# Altium schematic sheet FMCPower.SchDoc
size Letter; PageSetup: Record=PageOptions|CenterHorizontal=True|CenterVertical=True|PrintScale=1.00|XCorrection=1.00|YCorrection=1.00|PrintKind=0|BorderSize=5000000|LeftOffset=0|BottomOffset=0|Orientation=2|PaperLength=1000|PaperWidth=1000|Scale=100|PaperSource=7|PrintQuality=-4|MediaType=1|DitherType=10|PaperKind=Letter|PrintScaleMode=1; Author: Adam Gilbert; CompanyName: McGill University; DrawnBy: Adam Gilbert; Organization: Altium Limited; Address1: McGill Cosmology; Address2: 3600 University Street; Address3: Montreal, Quebec; Address4: Canada; DocumentNumber: 2; Revision: Rev2; SheetNumber: 2; SheetTotal: 16; ProjectTitle: DfMux FMC Mezz; ModelNumber: MGMEZZ04; ProjectName: DfMux FMC Mezz
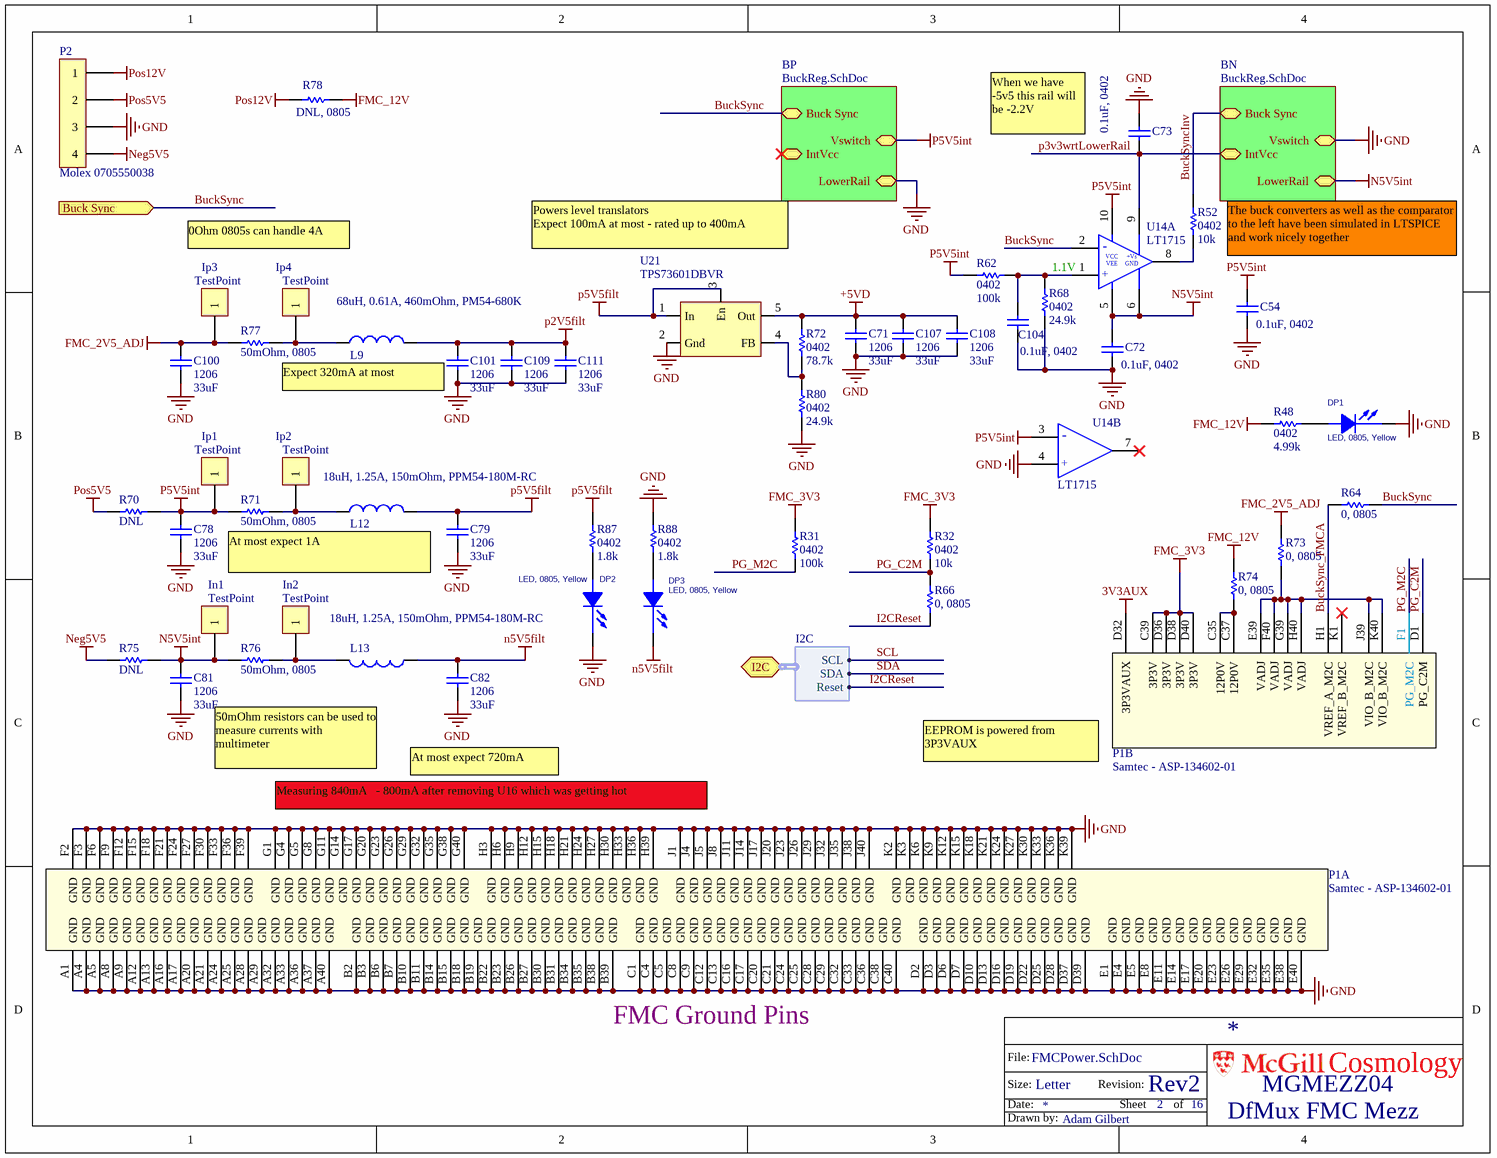
[diagram p0: FMCPower.SchDoc]

## Parts
C54  0.1uF, 0402  [0402]
C71  Footprint: 1206  [CC3225-1210]  (hidden comment: 33uF)
C72  0.1uF, 0402  [0402]
C73  0.1uF, 0402  [0402]
C78  Footprint: 1206  [CC3225-1210]  (hidden comment: 33uF)
C79  Footprint: 1206  [CC3225-1210]  (hidden comment: 33uF)
C81  Footprint: 1206  [CC3225-1210]  (hidden comment: 33uF)
C82  Footprint: 1206  [CC3225-1210]  (hidden comment: 33uF)
C100  Footprint: 1206  [CC3225-1210]  (hidden comment: 33uF)
C101  Footprint: 1206  [CC3225-1210]  (hidden comment: 33uF)
C104  0.1uF, 0402  [0402]
C107  Footprint: 1206  [CC3225-1210]  (hidden comment: 33uF)
C108  Footprint: 1206  [CC3225-1210]  (hidden comment: 33uF)
C109  Footprint: 1206  [CC3225-1210]  (hidden comment: 33uF)
C111  Footprint: 1206  [CC3225-1210]  (hidden comment: 33uF)
DP1  LED, 0805, Yellow  [0805L]
DP2  LED, 0805, Yellow  [0805L]
DP3  LED, 0805, Yellow  [0805L]
In1  TestPoint  [TP-3520-SK]  (no BOM)
In2  TestPoint  [TP-3520-SK]  (no BOM)
Ip1  TestPoint  [TP-3520-SK]  (no BOM)
Ip2  TestPoint  [TP-3520-SK]  (no BOM)
Ip3  TestPoint  [TP-3520-SK]  (no BOM)
Ip4  TestPoint  [TP-3520-SK]  (no BOM)
L9  Part Constraints: 68uH, 0.61A, 460mOhm, PM54-680K  [CHOKEPM54]  (hidden comment: 68uH)
L12  Part Constraints: 18uH, 1.25A, 150mOhm, PPM54-180M-RC  [CHOKEPM54]  (hidden comment: 18uH)
L13  Part Constraints: 18uH, 1.25A, 150mOhm, PPM54-180M-RC  [CHOKEPM54]  (hidden comment: 18uH)
P1  Samtec - ASP-134602-01  [BTB-SM1-27-2V400M]  (parts A,B of 14)
P2  Molex 0705550038  [Molex0705550038]
R31  100k  [0402]
R32  10k  [0402]
R48  4.99k  [0402]
R52  10k  [0402]
R62  100k  [0402]
R64  0, 0805  [0805]
R66  0, 0805  [0805]
R68  24.9k  [0402]
R70  DNL  [0805]
R71  50mOhm, 0805  [0805]
R72  78.7k  [0402]
R73  0, 0805  [0805]
R74  0, 0805  [0805]
R75  DNL  [0805]
R76  50mOhm, 0805  [0805]
R77  50mOhm, 0805  [0805]
R78  DNL, 0805  [0805]
R80  24.9k  [0402]
R87  1.8k  [0402]
R88  1.8k  [0402]
U14  LT1715  [TSSOP50P490X110-10N]  (parts A,B of 2)
U21  TPS73601DBVR  [SOT23-5]

## Sub-sheets
BN = BuckReg.SchDoc: Buck Sync, LowerRail, Vswitch, IntVcc
BP = BuckReg.SchDoc: Buck Sync, LowerRail, Vswitch, IntVcc

## Ports
Buck Sync (in), I2C (harness I2C)

## Harnesses
I2C: SCL, SDA, Reset

## Nets
3V3AUX: P1.D32(3P3VAUX)
+5VD: C71.1 C107.1 C108.1 R72.2 U21.5(Out)
FMC_2V5_ADJ: C100.1 Ip3.1 R73.2 R77.1
FMC_3V3: P1.C39(3P3V) P1.D36(3P3V) P1.D38(3P3V) P1.D40(3P3V) R31.1 R32.1
FMC_12V: R48.1 R74.2 R78.2
GND: C54.1 C71.2 C72.1 C73.2 C78.2 C79.2 C81.2 C82.2 C100.2 C101.2 C104.1 C107.2 C108.2 C109.2 C111.2 DP1.2(CATHODE) DP2.2(CATHODE) P1.A1(GND) P1.A4(GND) P1.A5(GND) P1.A8(GND) P1.A9(GND) P1.A12(GND) P1.A13(GND) P1.A16(GND) P1.A17(GND) P1.A20(GND) P1.A21(GND) P1.A24(GND) P1.A25(GND) P1.A28(GND) P1.A29(GND) P1.A32(GND) P1.A33(GND) P1.A36(GND) P1.A37(GND) P1.A40(GND) P1.B2(GND) P1.B3(GND) P1.B6(GND) P1.B7(GND) P1.B10(GND) P1.B11(GND) P1.B14(GND) P1.B15(GND) P1.B18(GND) P1.B19(GND) P1.B22(GND) P1.B23(GND) P1.B26(GND) P1.B27(GND) P1.B30(GND) P1.B31(GND) P1.B34(GND) P1.B35(GND) P1.B38(GND) P1.B39(GND) P1.C1(GND) P1.C4(GND) P1.C5(GND) P1.C8(GND) P1.C9(GND) P1.C12(GND) P1.C13(GND) P1.C16(GND) P1.C17(GND) P1.C20(GND) P1.C21(GND) P1.C24(GND) P1.C25(GND) P1.C28(GND) P1.C29(GND) P1.C32(GND) P1.C33(GND) P1.C36(GND) P1.C38(GND) P1.C40(GND) P1.D2(GND) P1.D3(GND) P1.D6(GND) P1.D7(GND) P1.D10(GND) P1.D13(GND) P1.D16(GND) P1.D19(GND) P1.D22(GND) P1.D25(GND) P1.D28(GND) P1.D37(GND) P1.D39(GND) P1.E1(GND) P1.E4(GND) P1.E5(GND) P1.E8(GND) P1.E11(GND) P1.E14(GND) P1.E17(GND) P1.E20(GND) P1.E23(GND) P1.E26(GND) P1.E29(GND) P1.E32(GND) P1.E35(GND) P1.E38(GND) P1.E40(GND) P1.F2(GND) P1.F3(GND) P1.F6(GND) P1.F9(GND) P1.F12(GND) P1.F15(GND) P1.F18(GND) P1.F21(GND) P1.F24(GND) P1.F27(GND) P1.F30(GND) P1.F33(GND) P1.F36(GND) P1.F39(GND) P1.G1(GND) P1.G4(GND) P1.G5(GND) P1.G8(GND) P1.G11(GND) P1.G14(GND) P1.G17(GND) P1.G20(GND) P1.G23(GND) P1.G26(GND) P1.G29(GND) P1.G32(GND) P1.G35(GND) P1.G38(GND) P1.G40(GND) P1.H3(GND) P1.H6(GND) P1.H9(GND) P1.H12(GND) P1.H15(GND) P1.H18(GND) P1.H21(GND) P1.H24(GND) P1.H27(GND) P1.H30(GND) P1.H33(GND) P1.H36(GND) P1.H39(GND) P1.J1(GND) P1.J4(GND) P1.J5(GND) P1.J8(GND) P1.J11(GND) P1.J14(GND) P1.J17(GND) P1.J20(GND) P1.J23(GND) P1.J26(GND) P1.J29(GND) P1.J32(GND) P1.J35(GND) P1.J38(GND) P1.J40(GND) P1.K2(GND) P1.K3(GND) P1.K6(GND) P1.K9(GND) P1.K12(GND) P1.K15(GND) P1.K18(GND) P1.K21(GND) P1.K24(GND) P1.K27(GND) P1.K30(GND) P1.K33(GND) P1.K36(GND) P1.K39(GND) P2.3 R68.2 R80.1 R88.1 U14.4(+) U21.2(Gnd) ; sheet BP/LowerRail, sheet BN/Vswitch
n5V5filt: C82.1 DP3.2(CATHODE) L13.1
N5V5int: C72.2 C81.1 In1.1 R75.1 R76.1 U14.5(Vee) U14.6(Gnd) ; sheet BN/LowerRail
Neg5V5: P2.4 R75.2
p2V5filt: C101.1 C109.1 C111.1 L9.2
p5V5filt: C79.1 L12.2 R87.1 U21.1(In) U21.3(En)
P5V5int: C54.2 C78.1 Ip1.1 R62.1 R70.1 R71.1 U14.3(-) U14.10(Vcc) ; sheet BP/Vswitch
Pos5V5: P2.2 R70.2
Pos12V: P2.1 R78.1
BuckSync: R64.1 U14.2(-) ; port Buck Sync, sheet BP/Buck Sync
BuckSync_FMCA: P1.H1(VREF_A_M2C) R64.2
BuckSyncInv: R52.1 ; sheet BN/Buck Sync
I2CReset: R66.2 ; port I2C.Reset
p3v3wrtLowerRail: C73.1 U14.9(Vs) ; sheet BN/IntVcc
PG_C2M: P1.D1(PG_C2M) R32.2 R66.1
PG_M2C: P1.F1(PG_M2C) R31.2
SCL: port I2C.SCL
SDA: port I2C.SDA
NetC104_2: C104.2 R62.2 R68.1 U14.1(+)
NetDP1_1: DP1.1(ANODE) R48.2
NetDP2_1: DP2.1(ANODE) R87.2
NetDP3_1: DP3.1(ANODE) R88.2
NetIn2_1: In2.1 L13.2 R76.2
NetIp2_1: Ip2.1 L12.1 R71.2
NetIp4_1: Ip4.1 L9.1 R77.2
NetP1_C35: P1.C35(12P0V) P1.C37(12P0V) R74.1
NetP1_E39: P1.E39(VADJ) P1.F40(VADJ) P1.G39(VADJ) P1.H40(VADJ) P1.J39(VIO_B_M2C) P1.K40(VIO_B_M2C) R73.1
NetR52_2: R52.2 U14.8(Out)
NetR72_1: R72.1 R80.2 U21.4(FB)

Not connected (* = marked no-connect by the designer): P1 K1(VREF_B_M2C)*; U14 7(Out)*

## Notes on the sheet
- When we have -5v5 this rail will be -2.2V
- 0Ohm 0805s can handle 4A
- Powers level translators
  Expect 100mA at most - rated up to 400mA
- 1.1V
- The buck converters as well as the comparator to the left have been simulated in LTSPICE and work nicely together
- Expect 320mA at most
- At most expect 1A
- 50mOhm resistors can be used to measure currents with multimeter
- At most expect 720mA
- EEPROM is powered from 3P3VAUX
- Measuring 840mA   - 800mA after removing U16 which was getting hot
- (near P1) FMC Ground Pins
- File:
- Size:
- Date:
- Letter
- Revision:
- Sheet
- of
- Cosmology
- Drawn by:
- (in symbol LT1715, part A) VCC; +Vs; VEE; GND

## Library data of the parts
C54 C72 C73 C104 = CAP 0603: Capacitor, Ceramic, 0402; Part Constraints: 10% 10V X5R 0402; Manufacturer: TDK Corporation; Manufacturer Part Number 1: C1005X5R1A104K050BA; Temperature Coefficient: X5R; Assembly Comments: none; Value: 0.1uF, 0402; Supplier 1: Digi-Key; Supplier Part Number 1: 445-1265-1-ND; Operating Temperature: -55°C ~ 85°C; Thickness (Max): 0.022" (0.55mm); Packaging: Cut Tape (CT)
C71 C78 C79 C81 C82 C100 C101 C107-C109 C111 = CAP 1210: Capacitor, Ceramic, 1210; Manufacturer: TDK Corporation; Part Constraints: 33uF or 47uF  (1206 or 1210) 25V X5R; Manufacturer Part Number 1: C3216X5R1E336M; Assembly Comments: none; Temperature Coefficient: X5R; Value: 33uF; Supplier 1: Digi-Key; Supplier Part Number 1: 445-8046-1-ND; Operating Temperature: -55°C ~ 85°C; Packaging: Cut Tape (CT)
DP1-DP3 = LED, yellow, 0805, 2mA: LED; Part Constraints: SML-211YTT86; Manufacturer: Rohm Semiconductor; Assembly Comments: none; Supplier 1: Digi-Key; Supplier Part Number 1: 511-1293-1-ND; Manufacturer Part Number 1: SML-211YTT86
In1 In2 Ip1-Ip4 = TestPoint: TestPoint1; Assembly Comments: none; Footprint: *
L9 = INDPM54: Inductor PM54; Manufacturer: Bourns Inc.; Manufacturer Part Number 1: PM54-680K; Assembly Comments: none; Footprint: PM54; Supplier 1: Digi-Key; Supplier Part Number 1: M8524CT-ND; Value: 68uH
L12 L13 = INDPM54: INDUCTOR UNSHIELD 18UH 1.25A SMD; Manufacturer Part Number 1: PM54-180M-RC; Manufacturer: Bourns Inc.; Assembly Comments: none; Value: 18uH; Supplier 1: Digi-Key; Supplier Part Number 1: M8516CT-ND; Packaging: Cut Tape (CT); Operating Temperature: -40°C ~ 125°C
P1 = Samtec - ASP-134602-01: Samtec ASP-134602-01; Assembly Comments: none; Manufacturer: Samtec; Part constraints: Samtec ASP-134602-01; Manufacturer Part Number 1: Samtec ASP-134602-01
P2 = Molex 4pin header - 0705550038: Assembly comments: none; Manufacturer: Molex; Manufacturer Part Number 1: 0705550038; Part Constraints: 0705550038; Supplier 1: Digikey; Supplier Part Number 1: WM4177-ND
R31 R32 R48 R52 R62 R68 R72 R80 R87 R88 = RES 0402: Resistor; Manufacturer: Generic; Part Constraints: 1% 1/10W 100ppm 0402; Assembly Comments: none; Manufacturer Part Number 1: Generic
  R31 R62: Value: 100k
  R32 R52: Value: 10k
  R48: Value: 4.99k
  R68 R80: Value: 24.9k
  R72: Value: 78.7k
  R87 R88: Value: 1.8k
R64 R66 R70 R73-R75 = Res1812: RES 0.0 OHM 1/8W 0805 SMD; Manufacturer: e.g Vishay/Dale; Part constraints: 0Ohm jumper, >=4A, 0805, <=5mOhms; Manufacturer Part Number 1: e.g CRCW08050000Z0EAHP; Value: 0; Assembly Comments: none; Supplier 1: Newark; Supplier Part Number 1: 68R2993
R71 R76 R77 = RES 0805: RES 50mOHM 1/4W 0805 SMD; Part constraints: ERJ-L06KF50MV; Manufacturer: Panasonic Electronic Components; Temperature Coefficient: ±100ppm/°C; Assembly Comments: none; Value: 50mOhm, 0805; Supplier 1: Digi-Key; Supplier Part Number 1: P50LLCT-ND; Manufacturer Part Number 1: ERJ-L06KF50MV; Packaging: Cut Tape (CT)
R78 = RES 0805: RES 0.0 OHM 1/8W 0805 SMD; Manufacturer: Generic; Part constraints: 1% 100ppm 1/8W 0805; Assembly Comments: none; Value: DNL, 0805; Manufacturer Part Number 1: Generic
U14 = LT1715: IC COMPARATOR 150MHZ DUAL 10MSOP; Manufacturer Part Number 1: LT1715IMS#PBF; Manufacturer: Linear Technology; Assembly Comments: none; Supplier 1: Digi-Key; Operating Temperature: -40°C ~ 85°C; Packaging: Tube; Supplier Part Number 1: LT1715IMS#PBF-ND; Part Constraints: LT1715IMS#PBF
U21 = TPS73601DBVR: Adjustable 30uVrms noise 400mA regulator; Manufacturer Part Number 1: TPS73601DBVT; Manufacturer: Texas Instruments; Assembly Comments: none; Supplier 1: Digi-Key; Operating Temperature: -40°C ~ 125°C; Packaging: Cut Tape (CT); Supplier Part Number 1: 296-15814-1-ND; Part Constraints: TPS73601DBVT